# Altium schematic sheet System.SchDoc
size A
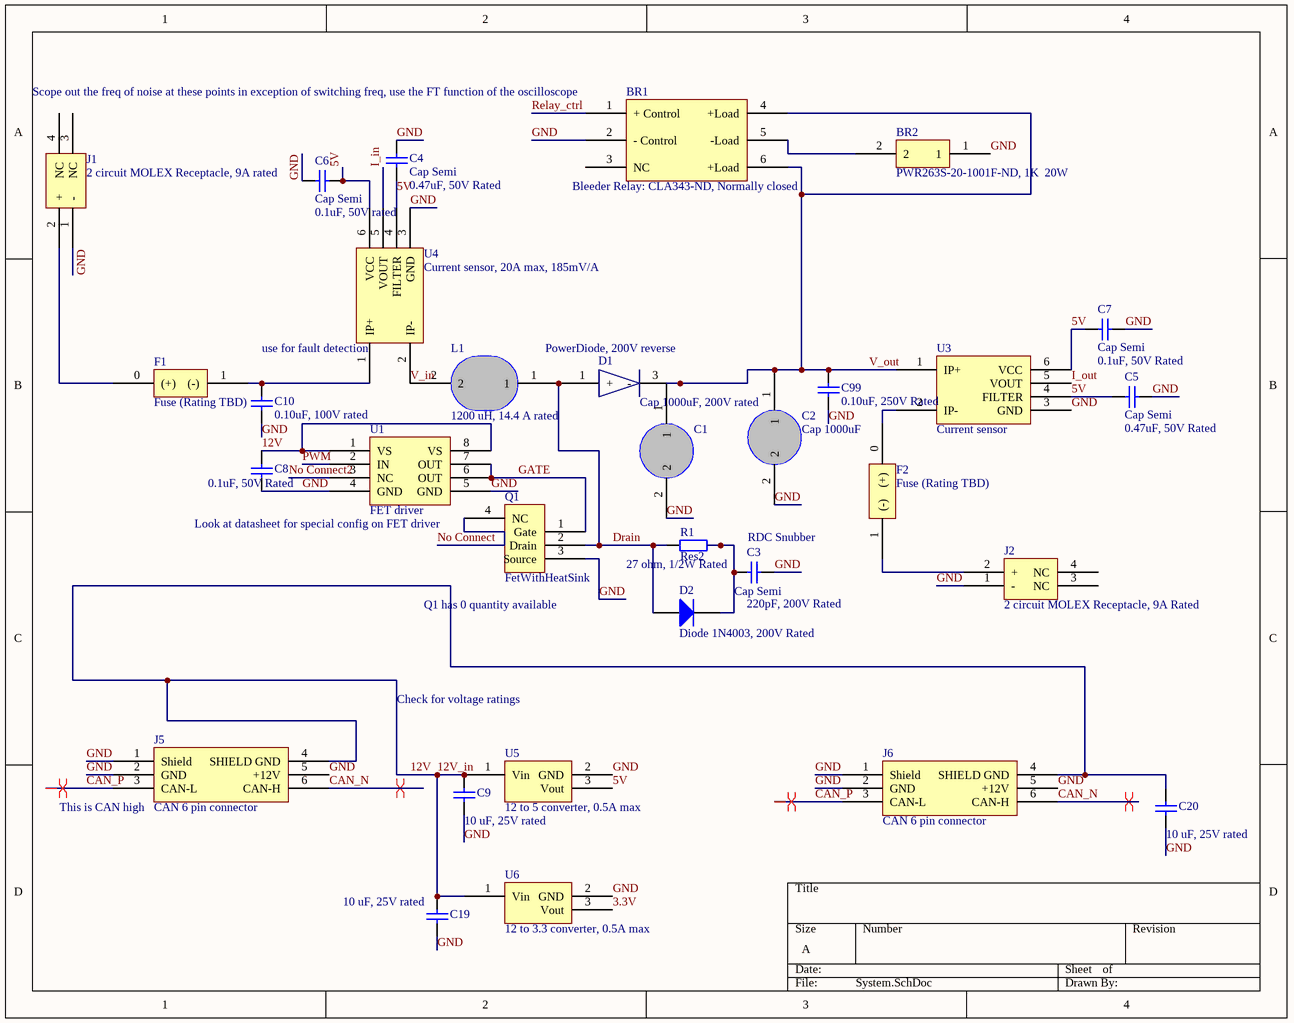
[diagram p0: System.SchDoc]

## Parts
BR1  Bleeder Relay: CLA343-ND, Normally closed  [Bleeder Relay: CLA343-ND]
BR2  PWR263S-20-1001F-ND, 1K  20W  [PWR263S-20-1001F-ND]
C1  Cap 1000uF, 200V rated  [LargeCap]
C2  Cap 1000uF  [LargeCap]
C3  Cap Semi  value 220pF, 200V Rated  [C1206]
C4  Cap Semi  value 0.47uF, 50V Rated  [C1206]
C5  Cap Semi  value 0.47uF, 50V Rated  [C1206]
C6  Cap Semi  value 0.1uF, 50V rated  [C1206]
C7  Cap Semi  value 0.1uF, 50V Rated  [C1206]
C8  value 0.1uF, 50V Rated  [C1206]  (hidden comment: Cap Semi)
C9  value 10 uF, 25V rated  [C1206]  (hidden comment: Cap Semi)
C10  value 0.10uF, 100V rated  [C1210]  (hidden comment: Cap Semi)
C19  value 10 uF, 25V rated  [C1206]  (hidden comment: Cap Semi)
C20  value 10 uF, 25V rated  [C1206]  (hidden comment: Cap Semi)
C99  value 0.10uF, 250V Rated  [C1210]  (hidden comment: Cap Semi)
D1  PowerDiode, 200V reverse  [PowerDiode]
D2  Diode 1N4003, 200V Rated  [Diode RDC]
F1  Fuse (Rating TBD)  [Fuseholder]
F2  Fuse (Rating TBD)  [Fuseholder]
J1  2 circuit MOLEX Receptacle, 9A rated  [2 circuit MOLEX Receptacle]
J2  2 circuit MOLEX Receptacle, 9A Rated  [2 circuit MOLEX Receptacle]
J5  CAN 6 pin connector  [CAN 6 pin connector]
J6  CAN 6 pin connector  [CAN 6 pin connector]
L1  1200 uH, 14.4 A rated  [Large Inductor]
Q1  FetWithHeatSink  [FetWithHeatSink]
R1  Res2  value 27 ohm, 1/2W Rated  [RES RDC]
U1  FET driver  [FET Driver]
U3  Current sensor  [Current sensor]
U4  Current sensor, 20A max, 185mV/A  [Current sensor]
U5  12 to 5 converter, 0.5A max  [12 to 5 converter]
U6  12 to 3.3 converter, 0.5A max  [12 to 5 converter]

## Nets
3.3V: U6.3(Vout)
5V: C4.1 C5.1 C6.1 C7.1 U3.4(FILTER) U3.6(VCC) U4.4(FILTER) U4.6(VCC) U5.3(Vout)
12V: C8.1 C9.2 C19.2 C20.2 J5.4(SHIELD_GND) J6.4(SHIELD_GND) U1.1(VS) U1.8(VS) U5.1(Vin) U6.1(Vin)  [also labelled 12V_in]
CAN_N: J5.6(CAN-H) J6.6(CAN-H)
CAN_P: J5.3(CAN-L) J6.3(CAN-L)
Drain: D1.1(+) D2.1(A) L1.1 Q1.2(Drain) R1.1
GATE: Q1.1(Gate) U1.6(OUT) U1.7(OUT)
GND: BR1.2(-_Control) BR2.1 C1.2 C2.2 C3.2 C4.2 C5.2 C6.2 C7.2 C8.2 C9.1 C10.2 C19.1 C20.1 C99.1 J1.1(-) J2.1(-) J5.1(Shield) J5.2(GND) J5.5(+12V) J6.1(Shield) J6.2(GND) J6.5(+12V) Q1.3(Source) U1.4(GND) U1.5(GND) U3.3(GND) U4.3(GND) U5.2(GND) U6.2(GND)
I_in: U4.5(VOUT)
I_out: U3.5(VOUT)
No Connect: Q1.4(NC)
No Connect2: U1.3(NC)
PWM: U1.2(IN)
Relay_ctrl: BR1.1(+_Control)
V_in: L1.2 U4.2(IP-)
V_out: BR1.4(+Load) BR1.6(+Load) C1.1 C2.1 C99.2 D1.3(-) U3.1(IP+)
NetBR1_5: BR1.5(-Load) BR2.2
NetC3_1: C3.1 D2.2(K) R1.2
NetC10_1: C10.1 F1.1((-)) U4.1(IP+)
NetF1_0: F1.0((+)) J1.2(+)
NetF2_0: F2.0((+)) U3.2(IP-)
NetF2_1: F2.1((-)) J2.2(+)

Not connected (* = marked no-connect by the designer): BR1 3(NC); J1 3(NC) 4(NC); J2 3(NC) 4(NC)

## Layout directives
differential pair: CAN_N, CAN_P

## Notes on the sheet
- (near BR1) Scope out the freq of noise at these points in exception of switching freq, use the FT function of the oscilloscope
- (near U4) use for fault detection
- (near Q1) Look at datasheet for special config on FET driver
- RDC Snubber
- (near Q1) Q1 has 0 quantity available
- Check for voltage ratings
- (near J5) This is CAN high

## Library data of the parts
BR1 = Bleeder Relay: CLA343-ND
BR2 = PWR263S-20-1001F-ND
C1 C2 = Cap 1200uF
C3-C10 C19 C20 C99 = Cap Semi: Capacitor (Semiconductor SIM Model); Published: 8-Jun-2000; LatestRevisionDate: 29-May-2009; LatestRevisionNote: IPC-7351 Footprint Added.; PackageReference: C1206; Publisher: Altium Limited; PackageDescription: Chip Capacitor
D1 = PowerDiode
D2 = Diode 1N4003: 1 Amp General Purpose Rectifier; Published: 8-Jun-2000; LatestRevisionDate: 17-Jul-2002; LatestRevisionNote: Re-released for DXP Platform.; DatasheetVersion: 1998; PackageVersion: Aug-1999; PackageReference: DO-41; Publisher: Altium Limited; PackageDescription: Diode, Axial; Body 5.2 x 2.7 mm (LxDia. max), Lead Dia. 0.86 mm (max); Code_JEDEC: DO-204-AL; ComponentLink1Description: Manufacturer Link; ComponentLink1URL: http://www.fairchildsemi.com/; ComponentLink2Description: Datasheet; ComponentLink2URL: http://www.fairchildsemi.com/ds/1N%2F1N4001.pdf
F1 F2 = Fuseholder
J1 J2 = 2 circuit MOLEX Receptacle
L1 = Large inductor: 120 uH
R1 = Res2: Resistor; Published: 8-Jun-2000; LatestRevisionDate: 17-Jul-2002; LatestRevisionNote: Re-released for DXP Platform.; PackageReference: AXIAL-0.4; Publisher: Altium Limited; PackageDescription: Axial Device, Thru-Hole; 2 Leads; 0.4 in Pin Spacing
U3 = Current sensor: This is the new current sensor 620-1262-1-ND
U4 = Current sensor: This is the new current sensor 620-1262-1-ND. Cap at filter pin determines the bandwidth of the device
U5 U6 = 12 to 5 converter